# Altium schematic sheet NU-SYNTHS_MIDICV.SchDoc
size A3; SheetNumber: 1; SheetTotal: 5
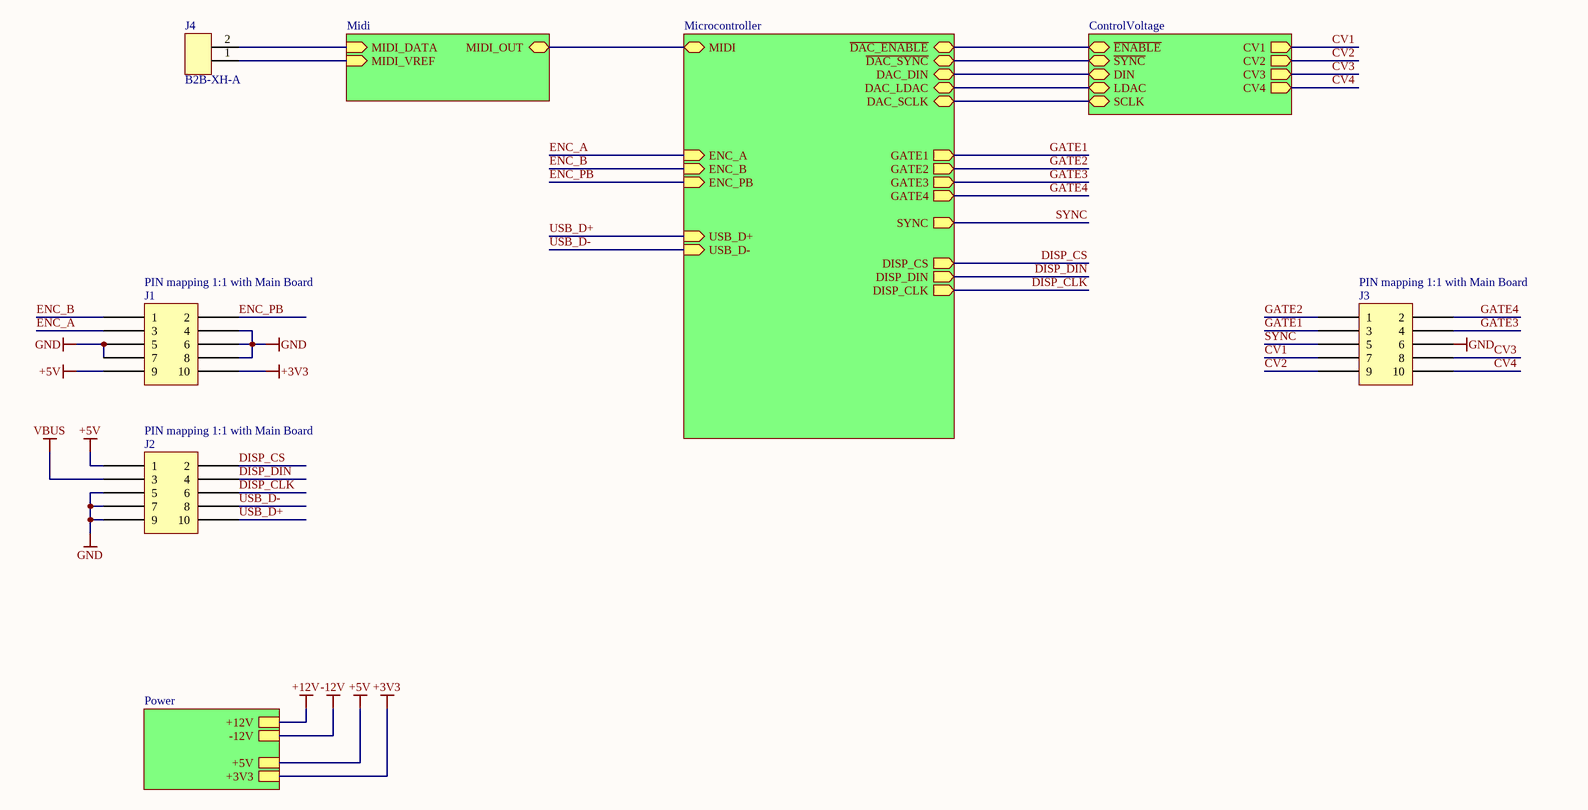
[diagram p0: NU-SYNTHS_MIDICV.SchDoc]

## Parts
J1  GENERIC_HEADER_2x5  [HEADER_2x5_SMD_FEMALE]  (value not drawn)
J2  GENERIC_HEADER_2x5  [HEADER_2x5_SMD_FEMALE]  (value not drawn)
J3  GENERIC_HEADER_2x5  [HEADER_2x5_SMD_FEMALE]  (value not drawn)
J4  B2B-XH-A  [JST_HEADER_1x2_SMD_MALE]

## Sub-sheets
CONTROLVOLTAGE = ControlVoltage: CV1 (out), CV2 (out), CV3 (out), CV4 (out), ~{ENABLE} (bidir), ~{SYNC} (bidir), SCLK (bidir), DIN (bidir), LDAC (bidir)
MICROCONTROLLER = Microcontroller: MIDI (bidir), DAC_SCLK (bidir), ~{DAC_ENABLE} (bidir), ~{DAC_SYNC} (bidir), DAC_DIN (bidir), ENC_A (in), ENC_PB (in), ENC_B (in), USB_D+ (in), USB_D- (in), GATE1 (out), GATE2 (out), GATE3 (out), GATE4 (out), DISP_CS (out), DISP_CLK (out), DISP_DIN (out), DAC_LDAC (bidir), SYNC (out)
MIDI = Midi: MIDI_OUT (bidir), MIDI_DATA (in), MIDI_VREF (in)
POWER = Power: +12V, -12V, +5V, +3V3

## Nets
+3V3: J1.10 ; sheet POWER/+3V3
+5V: J1.9 J2.1 ; sheet POWER/+5V
+12V: sheet POWER/+12V
-12V: sheet POWER/-12V
GND: J1.4 J1.5 J1.6 J1.7 J1.8 J2.5 J2.7 J2.9 J3.6
VBUS: J2.3
CV1: J3.7 ; sheet CONTROLVOLTAGE/CV1
CV2: J3.9 ; sheet CONTROLVOLTAGE/CV2
CV3: J3.8 ; sheet CONTROLVOLTAGE/CV3
CV4: J3.10 ; sheet CONTROLVOLTAGE/CV4
DISP_CLK: J2.6 ; sheet MICROCONTROLLER/DISP_CLK
DISP_CS: J2.2 ; sheet MICROCONTROLLER/DISP_CS
DISP_DIN: J2.4 ; sheet MICROCONTROLLER/DISP_DIN
ENC_A: J1.3 ; sheet MICROCONTROLLER/ENC_A
ENC_B: J1.1 ; sheet MICROCONTROLLER/ENC_B
ENC_PB: J1.2 ; sheet MICROCONTROLLER/ENC_PB
GATE1: J3.3 ; sheet MICROCONTROLLER/GATE1
GATE2: J3.1 ; sheet MICROCONTROLLER/GATE2
GATE3: J3.4 ; sheet MICROCONTROLLER/GATE3
GATE4: J3.2 ; sheet MICROCONTROLLER/GATE4
SYNC: J3.5 ; sheet MICROCONTROLLER/SYNC
USB_D+: J2.10 ; sheet MICROCONTROLLER/USB_D+
USB_D-: J2.8 ; sheet MICROCONTROLLER/USB_D-
NetJ4_1: J4.1 ; sheet MIDI/MIDI_VREF
NetJ4_2: J4.2 ; sheet MIDI/MIDI_DATA
(unnamed): sheet MICROCONTROLLER/MIDI, sheet MIDI/MIDI_OUT
(unnamed): sheet MICROCONTROLLER/DAC_SCLK, sheet CONTROLVOLTAGE/SCLK
(unnamed): sheet MICROCONTROLLER/~{DAC_ENABLE}, sheet CONTROLVOLTAGE/~{ENABLE}
(unnamed): sheet MICROCONTROLLER/~{DAC_SYNC}, sheet CONTROLVOLTAGE/~{SYNC}
(unnamed): sheet MICROCONTROLLER/DAC_DIN, sheet CONTROLVOLTAGE/DIN
(unnamed): sheet MICROCONTROLLER/DAC_LDAC, sheet CONTROLVOLTAGE/LDAC

## Notes on the sheet
- (near J1) PIN mapping 1:1 with Main Board
- (near J3) PIN mapping 1:1 with Main Board
- (near J2) PIN mapping 1:1 with Main Board

## Library data of the parts
J1-J3 = GENERIC_HEADER_2x5: Generic 2x5 header; Supplier 1: Farnell; Supplier Part Number 1: 2396199
J4 = B2B-XH-A(LF)(SN): Connector Header Through Hole 2 position 0.098 (2.50mm); MF: JST Sales; Value: *; Check_prices: https://www.snapeda.com/parts/B2B-XH-A(LF)(SN)/JST%20Sales%20America%20Inc./view-part/492310/?ref=eda; MP: B2B-XH-A(LF)(SN); Price: None; Package: None; Availability: In Stock; SnapEDA_Link: https://www.snapeda.com/parts/B2B-XH-A(LF)(SN)/JST%20Sales%20America%20Inc./view-part/492310/?ref=snap